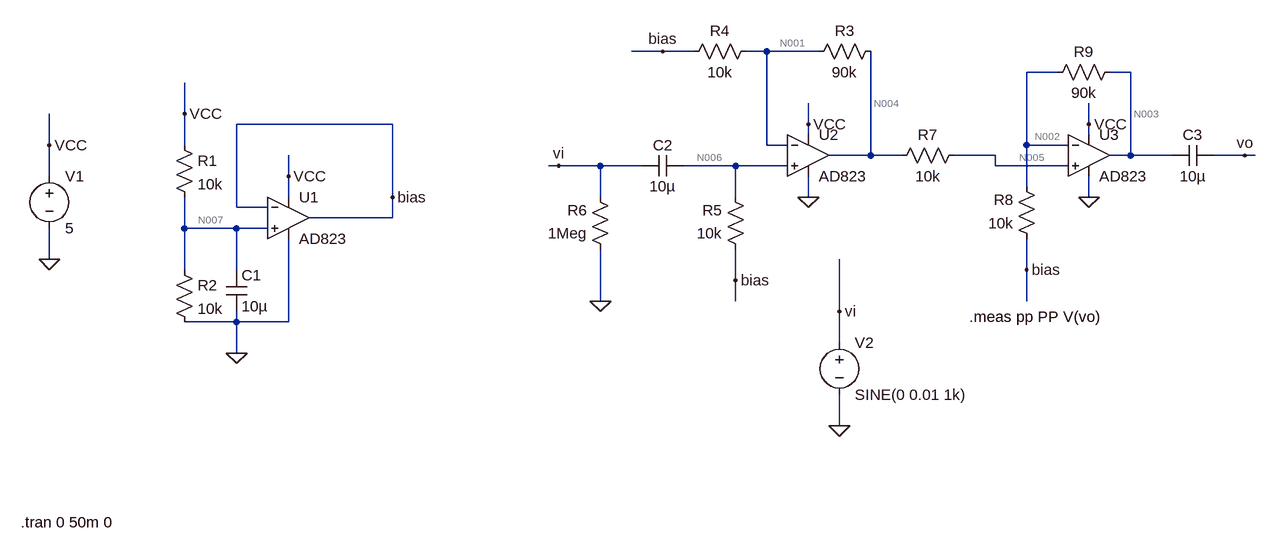
[diagram p0: schematic 2_19.asc]
2_19.asc, the LTspice schematic file:
Version 4
SHEET 1 1072 680
WIRE 144 -416 96 -416
WIRE 192 -416 144 -416
WIRE 304 -416 272 -416
WIRE 384 -416 304 -416
WIRE 752 -384 704 -384
WIRE 864 -384 832 -384
WIRE -592 -320 -592 -368
WIRE -272 -304 -512 -304
WIRE 368 -304 368 -336
WIRE 800 -304 800 -336
WIRE 368 -288 368 -304
WIRE 800 -288 800 -304
WIRE -800 -272 -800 -320
WIRE -592 -272 -592 -320
WIRE 304 -272 304 -416
WIRE 336 -272 304 -272
WIRE 704 -272 704 -384
WIRE 768 -272 704 -272
WIRE 464 -256 464 -416
WIRE 464 -256 400 -256
WIRE 512 -256 464 -256
WIRE 656 -256 592 -256
WIRE 864 -256 864 -384
WIRE 864 -256 832 -256
WIRE 928 -256 864 -256
WIRE 1040 -256 992 -256
WIRE 1056 -256 1040 -256
WIRE -16 -240 -32 -240
WIRE 48 -240 -16 -240
WIRE 112 -240 48 -240
WIRE 256 -240 176 -240
WIRE 336 -240 256 -240
WIRE 656 -240 656 -256
WIRE 768 -240 656 -240
WIRE -800 -224 -800 -272
WIRE -432 -224 -432 -256
WIRE 704 -208 704 -272
WIRE -432 -192 -432 -224
WIRE -272 -192 -272 -304
WIRE 48 -192 48 -240
WIRE 256 -192 256 -240
WIRE 368 -192 368 -224
WIRE 800 -192 800 -224
WIRE -512 -176 -512 -304
WIRE -464 -176 -512 -176
WIRE -272 -160 -272 -192
WIRE -272 -160 -400 -160
WIRE -592 -144 -592 -192
WIRE -512 -144 -592 -144
WIRE -464 -144 -512 -144
WIRE -800 -96 -800 -144
WIRE -592 -80 -592 -144
WIRE -512 -80 -512 -144
WIRE 704 -80 704 -128
WIRE 256 -64 256 -112
WIRE 48 -32 48 -112
WIRE 256 -32 256 -64
WIRE 704 -32 704 -80
WIRE 416 -16 416 -96
WIRE -512 0 -512 -16
WIRE -512 0 -592 0
WIRE -432 0 -432 -128
WIRE -432 0 -512 0
WIRE 416 32 416 -16
WIRE -512 48 -512 0
WIRE 416 160 416 112
FLAG -800 -96 0
FLAG -800 -272 VCC
FLAG -432 -224 VCC
FLAG -592 -320 VCC
FLAG 1040 -256 vo
FLAG -16 -240 vi
FLAG 368 -304 VCC
FLAG 800 -304 VCC
FLAG 416 160 0
FLAG 416 -16 vi
FLAG 48 -32 0
FLAG 368 -192 0
FLAG 800 -192 0
FLAG -512 48 0
FLAG -272 -192 bias
FLAG 256 -64 bias
FLAG 704 -80 bias
FLAG 144 -416 bias
SYMBOL OpAmps\\AD823 -432 -224 R0
SYMATTR InstName U1
SYMBOL OpAmps\\AD823 368 -320 R0
SYMATTR InstName U2
SYMBOL OpAmps\\AD823 800 -320 R0
SYMATTR InstName U3
SYMBOL voltage -800 -240 R0
WINDOW 123 0 0 Left 0
WINDOW 39 0 0 Left 0
SYMATTR InstName V1
SYMATTR Value 5
SYMBOL res -608 -288 R0
SYMATTR InstName R1
SYMATTR Value 10k
SYMBOL res -608 -96 R0
SYMATTR InstName R2
SYMATTR Value 10k
SYMBOL cap -528 -80 R0
SYMATTR InstName C1
SYMATTR Value 10µ
SYMBOL res 480 -432 R90
WINDOW 0 0 56 VBottom 2
WINDOW 3 32 56 VTop 2
SYMATTR InstName R3
SYMATTR Value 90k
SYMBOL res 288 -432 R90
WINDOW 0 0 56 VBottom 2
WINDOW 3 32 56 VTop 2
SYMATTR InstName R4
SYMATTR Value 10k
SYMBOL res 272 -96 R180
WINDOW 0 36 76 Left 2
WINDOW 3 36 40 Left 2
SYMATTR InstName R5
SYMATTR Value 10k
SYMBOL res 64 -96 R180
WINDOW 0 36 76 Left 2
WINDOW 3 36 40 Left 2
SYMATTR InstName R6
SYMATTR Value 1Meg
SYMBOL cap 176 -256 R90
WINDOW 0 0 32 VBottom 2
WINDOW 3 32 32 VTop 2
SYMATTR InstName C2
SYMATTR Value 10µ
SYMBOL res 608 -272 R90
WINDOW 0 0 56 VBottom 2
WINDOW 3 32 56 VTop 2
SYMATTR InstName R7
SYMATTR Value 10k
SYMBOL res 720 -112 R180
WINDOW 0 36 76 Left 2
WINDOW 3 36 40 Left 2
SYMATTR InstName R8
SYMATTR Value 10k
SYMBOL res 736 -368 R270
WINDOW 0 32 56 VTop 2
WINDOW 3 0 56 VBottom 2
SYMATTR InstName R9
SYMATTR Value 90k
SYMBOL cap 992 -272 R90
WINDOW 0 0 32 VBottom 2
WINDOW 3 32 32 VTop 2
SYMATTR InstName C3
SYMATTR Value 10µ
SYMBOL voltage 416 16 R0
WINDOW 123 0 0 Left 0
WINDOW 39 0 0 Left 0
SYMATTR InstName V2
SYMATTR Value SINE(0 0.01 1k)
TEXT -844 308 Left 2 !.tran 0 50m 0
TEXT 616 -8 Left 2 !.meas pp PP V(vo)

The netlist it stands for:
* 2_19.asc
XU1 N007 bias VCC 0 bias AD823  ; pins In+ In- V+ V- OUT
XU2 N006 N001 VCC 0 N004 AD823  ; pins In+ In- V+ V- OUT
XU3 N005 N002 VCC 0 N003 AD823  ; pins In+ In- V+ V- OUT
V1 VCC 0 5
R1 VCC N007 10k
R2 N007 0 10k
C1 N007 0 10µ
R3 N004 N001 90k
R4 N001 bias 10k
R5 bias N006 10k
R6 0 vi 1Meg
C2 N006 vi 10µ
R7 N005 N004 10k
R8 bias N002 10k
R9 N002 N003 90k
C3 vo N003 10µ
V2 vi 0 SINE(0 0.01 1k)
.tran 0 50m 0
.meas pp PP V(vo)
.lib ADI.lib
.backanno
.end

* Results of the author's LTspice run, read from the files saved beside the schematic
* Operating Point, zero values left out:
*   V(vcc) = 5 V
*   V(bias) = 2.5 V
*   V(n007) = 2.5 V
*   V(n001) = 2.5 V
*   V(n006) = 2.5 V
*   V(n004) = 2.5 V
*   V(n002) = 2.5 V
*   V(n005) = 2.5 V
*   V(n003) = 2.5 V
*   V(vo) = 25 µV
*   I(R9) = -5 pA
*   I(R8) = -10 pA
*   I(R7) = 5 pA
*   I(R5) = -5 pA
*   I(R4) = 5 pA
*   I(R2) = 250 µA
*   I(R1) = 250 µA
*   I(V1) = -8.062 mA
*   Ix(u1:1) = -5 pA
*   Ix(u1:2) = -5 pA
*   Ix(u1:3) = 2.604 mA
*   Ix(u1:4) = -2.604 mA
*   Ix(u1:5) = 25 pA
*   Ix(u2:1) = -5 pA
*   Ix(u2:2) = -5 pA
*   Ix(u2:3) = 2.604 mA
*   Ix(u2:4) = -2.604 mA
*   Ix(u2:5) = 5 pA
*   Ix(u3:1) = -5 pA
*   Ix(u3:2) = -5 pA
*   Ix(u3:3) = 2.604 mA
*   Ix(u3:4) = -2.604 mA
*   Ix(u3:5) = -5 pA
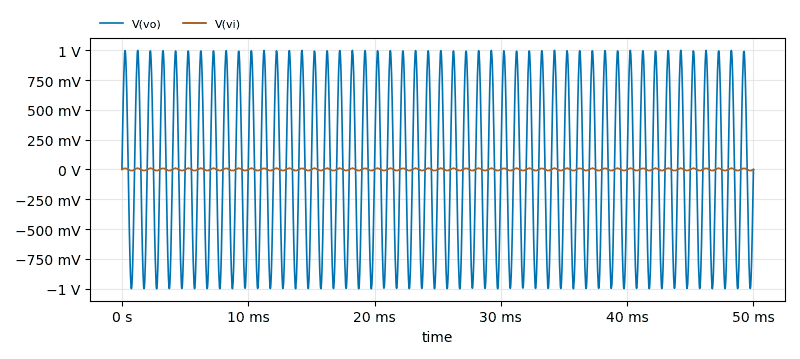
[diagram p1: Transient Analysis of 2_19.asc, plotted from the saved traces]
* Transient Analysis, 1 run:
*   V(vo): min -1.001 V, max 998.9 mV, average -1.451 mV, rms 701 mV, last -473.3 µV
*   V(vi): min -10 mV, max 10 mV, average -478.9 nV, rms 7.089 mV, last 0 V
* From the log:
*   pp: PP(v(vo))=2.0001 FROM 0 TO 0.05